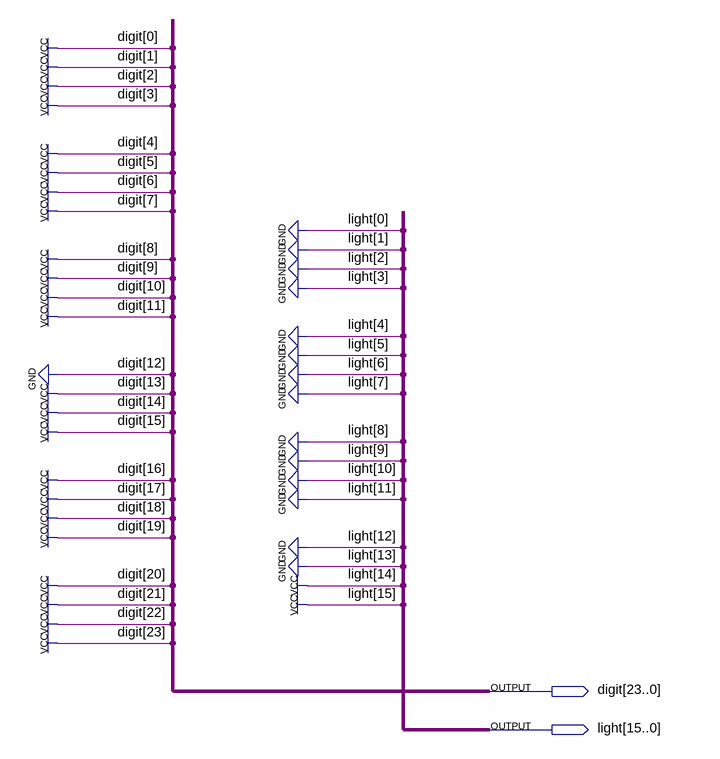
[diagram p0: schematic sheet]
// Quartus schematic Pattern_7_Frame_9.bdf as structural Verilog: 0 symbols, 2 pins
module Pattern_7_Frame_9 (
  output [23:0] digit,
  output [15:0] light
);


  assign digit = 24'b111111111110111111111111;
  assign light = 16'b1100000000000000;
endmodule
